# EAGLE design frc_operator_interface (EAGLE 7.5.0)
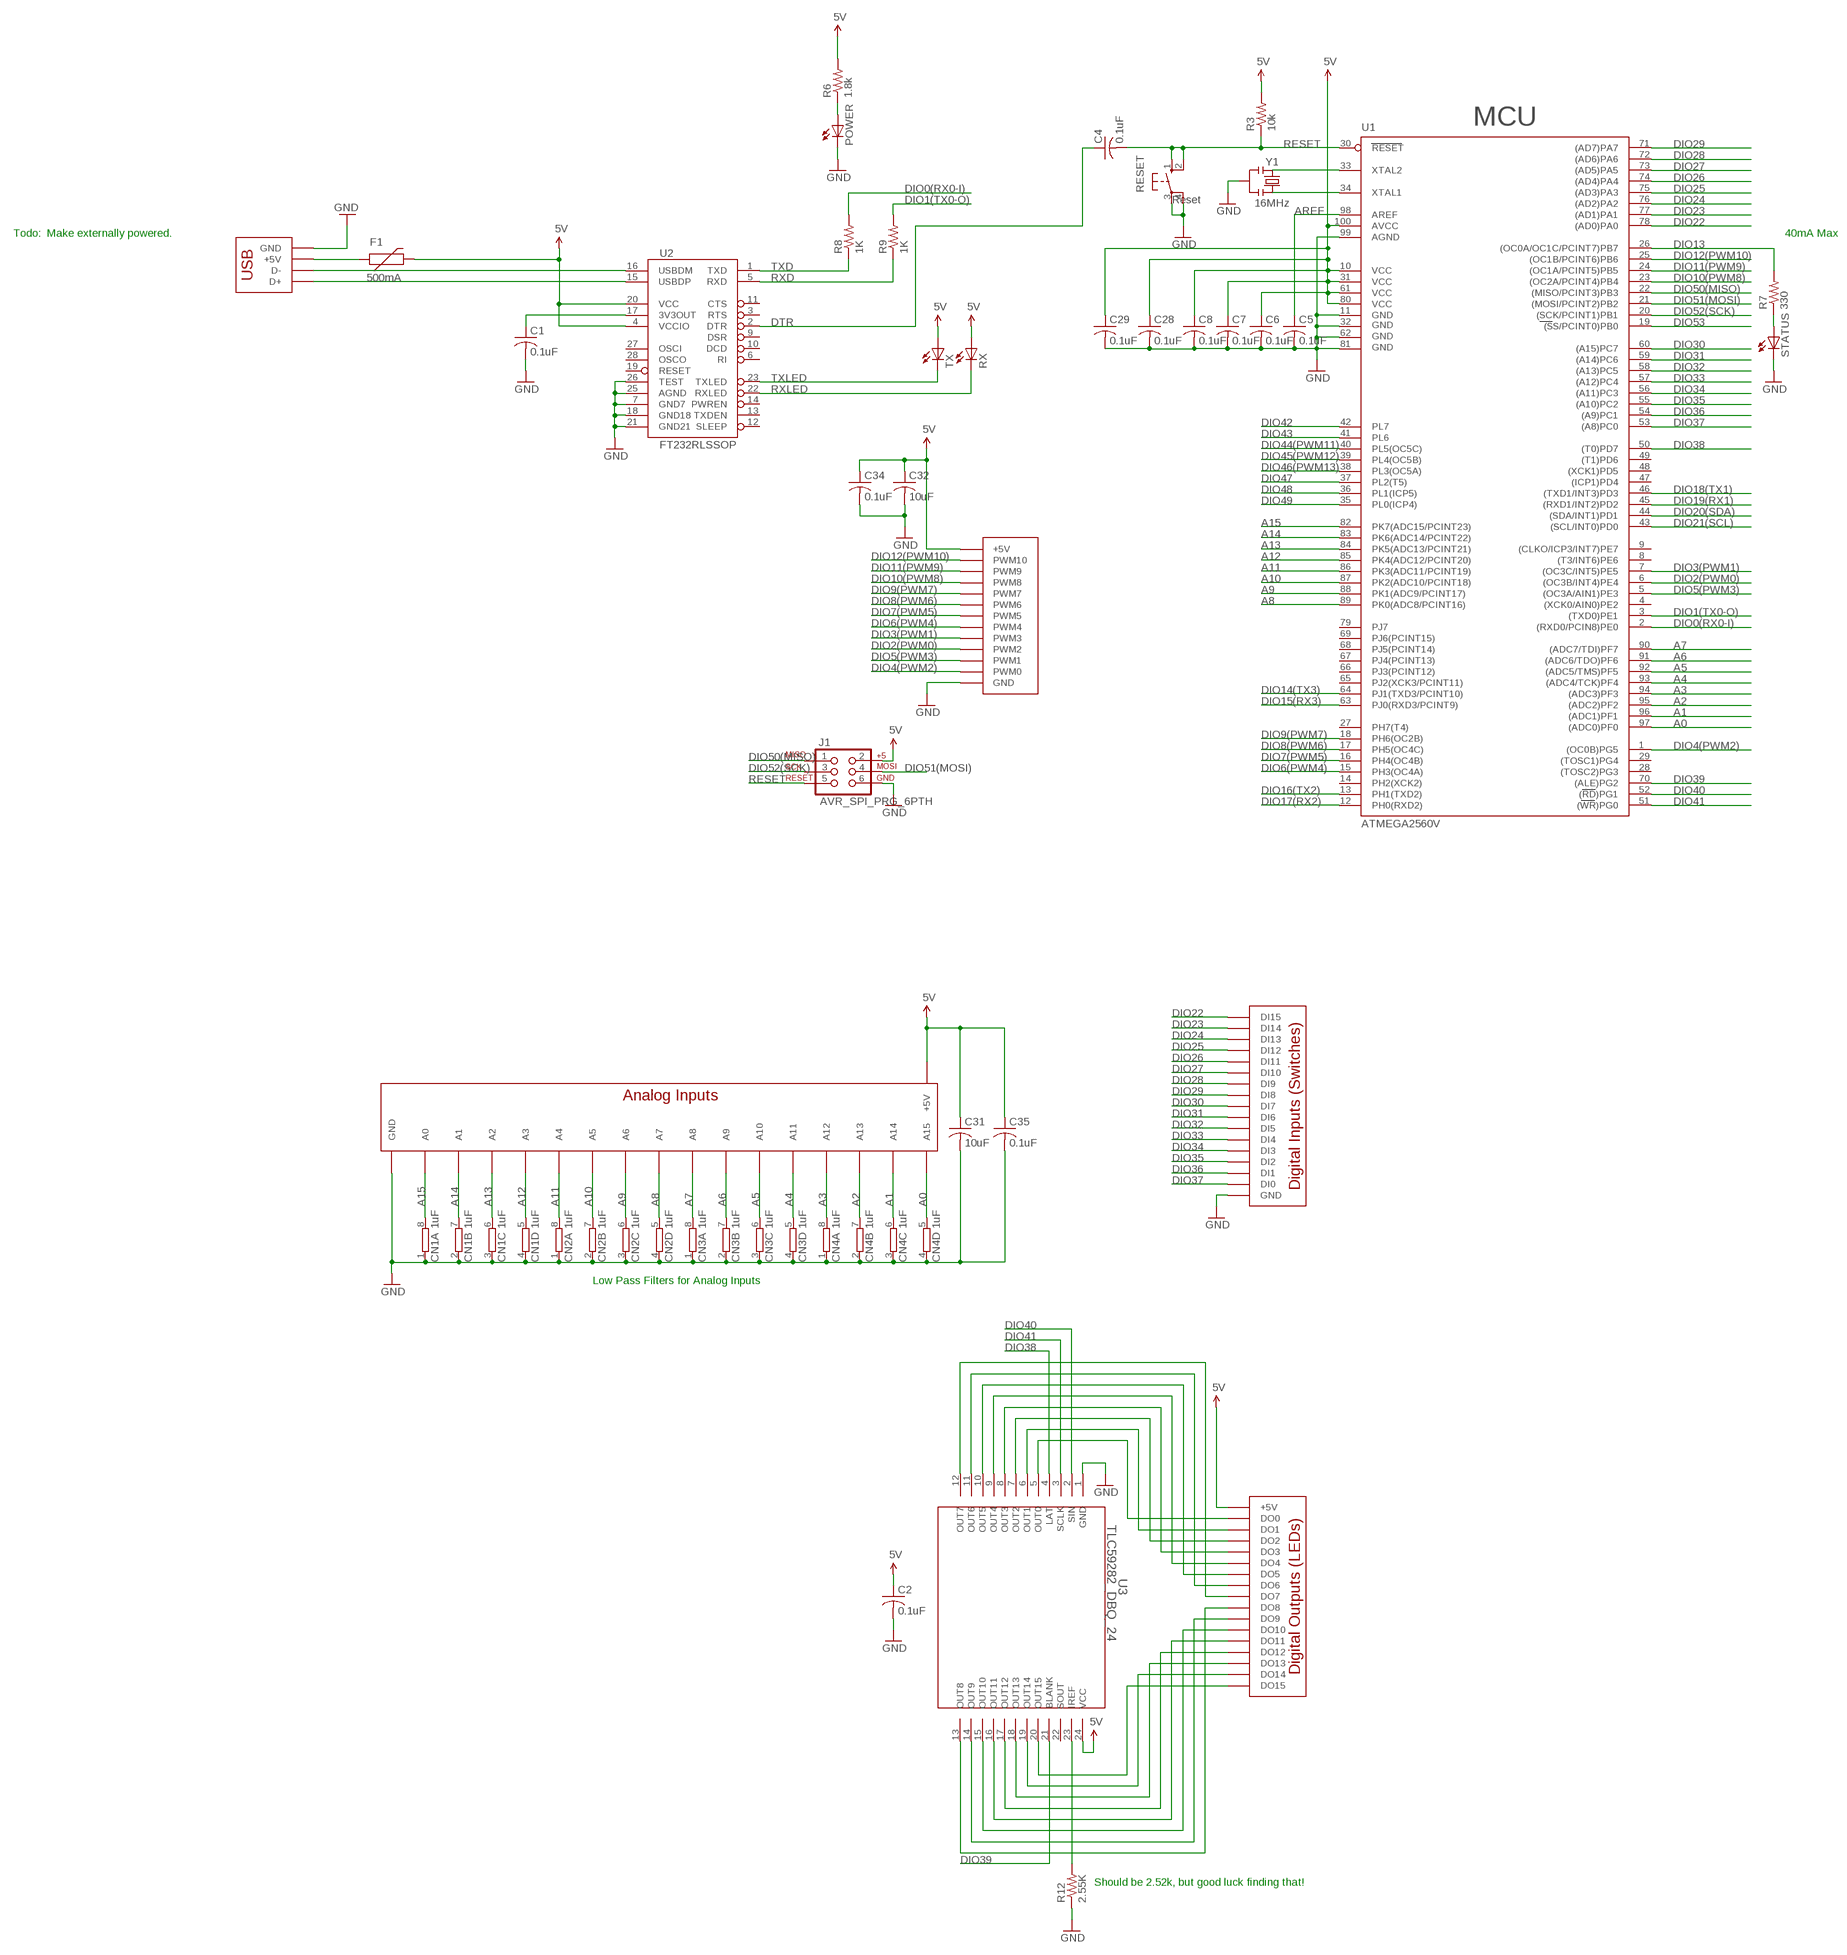
[diagram p0: schematic, sheet 1]

## Parts
C1  0.1uF  C-USC1206  [C1206]
C2  0.1uF  C-USC1206  [C1206]
C4  0.1uF  C-USC1206  [C1206]
C5  0.1uF  C-USC1206  [C1206]
C6  0.1uF  C-USC1206  [C1206]
C7  0.1uF  C-USC1206  [C1206]
C8  0.1uF  C-USC1206  [C1206]
C28  0.1uF  C-USC1206  [C1206]
C29  0.1uF  C-USC1206  [C1206]
C31  10uF  C-USC1206  [C1206]
C32  10uF  C-USC1206  [C1206]
C34  0.1uF  C-USC1206  [C1206]
C35  0.1uF  C-USC1206  [C1206]
CN1  1uF  4R-NEXB38V  [EXB38V]
CN2  1uF  4R-NEXB38V  [EXB38V]
CN3  1uF  4R-NEXB38V  [EXB38V]
CN4  1uF  4R-NEXB38V  [EXB38V]
F1  500mA  PTCSMD  [PTC-1206]
J1  AVR_SPI_PRG_6PTH  [2X3]
J2  ANALOGHEADER  [ANALOGHEADER]
J3  DIGITALIN  [DIGITALIN]
J4  DIGITALOUTPUTS  [DIGITALOUT]
J5  PWMHEADER  [PWMHEADER]
J6  UE27BC54130-USB  [UE27BC54130-USB]
POWER  LED3MM  [LED3MM]
R3  10k  R-US_M1206  [M1206]
R6  1.8k  R-US_M1206  [M1206]
R7  330  R-US_M1206  [M1206]
R8  1K  R-US_M1206  [M1206]
R9  1K  R-US_M1206  [M1206]
R12  2.55K  R-US_M1206  [M1206]
RESET  10-XX  [B3F-10XX]
RX  LED3MM  [LED3MM]
STATUS  LED3MM  [LED3MM]
TX  LED3MM  [LED3MM]
U1  ATMEGA2560AU  [TQFP100]
U2  FT232RLSSOP  [SSOP28DB]
U3  TLC59282_DBQ_24  [DBQ24]
Y1  RESONATORSMD  [RESONATOR-SMD]

## Nets
5V [power]: C2.1 C6.1 C7.1 C8.1 C28.1 C29.1 C31.1 C32.1 C34.1 C35.1 F1.2 J1.2 J2.+5V@0(+5V) J2.+5V@1(+5V) J2.+5V@2(+5V) J2.+5V@3(+5V) J2.+5V@4(+5V) J2.+5V@5(+5V) J2.+5V@6(+5V) J2.+5V@7(+5V) J2.+5V@8(+5V) J2.+5V@9(+5V) J2.+5V@10(+5V) J2.+5V@11(+5V) J2.+5V@12(+5V) J2.+5V@13(+5V) J2.+5V@14(+5V) J2.+5V@15(+5V) J4.+5V@0(+5V) J4.+5V@1(+5V) J4.+5V@2(+5V) J4.+5V@3(+5V) J4.+5V@4(+5V) J4.+5V@5(+5V) J4.+5V@6(+5V) J4.+5V@7(+5V) J4.+5V@8(+5V) J4.+5V@9(+5V) J4.+5V@10(+5V) J4.+5V@11(+5V) J4.+5V@12(+5V) J4.+5V@13(+5V) J4.+5V@14(+5V) J4.+5V@15(+5V) J5.+5V@3(+5V) J5.+5V@4(+5V) J5.+5V@5(+5V) J5.+5V@6(+5V) J5.+5V@7(+5V) J5.+5V@8(+5V) J5.+5V@9(+5V) J5.+5V@10(+5V) J5.+5V@11(+5V) J5.+5V@12(+5V) J5.+5V@13(+5V) R3.2 R6.2 RX.A TX.A U1.10(VCC) U1.31(VCC1) U1.61(VCC2) U1.80(VCC3) U1.100(AVCC) U2.4(VCCIO) U2.20(VCC) U3.24(VCC)
A0: CN4.5 J2.15(A15) U1.97((ADC0)PF0)
A1: CN4.6 J2.14(A14) U1.96((ADC1)PF1)
A2: CN4.7 J2.13(A13) U1.95((ADC2)PF2)
A3: CN4.8 J2.12(A12) U1.94((ADC3)PF3)
A4: CN3.5 J2.11(A11) U1.93((ADC4/TCK)PF4)
A5: CN3.6 J2.10(A10) U1.92((ADC5/TMS)PF5)
A6: CN3.7 J2.9(A9) U1.91((ADC6/TDO)PF6)
A7: CN3.8 J2.8(A8) U1.90((ADC7/TDI)PF7)
A8: CN2.5 J2.7(A7) U1.89(PK0(ADC8/PCINT16))
A9: CN2.6 J2.6(A6) U1.88(PK1(ADC9/PCINT17))
A10: CN2.7 J2.5(A5) U1.87(PK2(ADC10/PCINT18))
A11: CN2.8 J2.4(A4) U1.86(PK3(ADC11/PCINT19))
A12: CN1.5 J2.3(A3) U1.85(PK4(ADC12/PCINT20))
A13: CN1.6 J2.2(A2) U1.84(PK5(ADC13/PCINT21))
A14: CN1.7 J2.1(A1) U1.83(PK6(ADC14/PCINT22))
A15: CN1.8 J2.0(A0) U1.82(PK7(ADC15/PCINT23))
AREF: C5.1 U1.98(AREF)
DIO0(RX0-I): R8.2 U1.2((RXD0/PCIN8)PE0)
DIO1(TX0-O): R9.2 U1.3((TXD0)PE1)
DIO2(PWM0): J5.2(PWM2) U1.6((OC3B/INT4)PE4)
DIO3(PWM1): J5.3(PWM3) U1.7((OC3C/INT5)PE5)
DIO4(PWM2): J5.0(PWM0) U1.1((OC0B)PG5)
DIO5(PWM3): J5.1(PWM1) U1.5((OC3A/AIN1)PE3)
DIO6(PWM4): J5.4(PWM4) U1.15(PH3(OC4A))
DIO7(PWM5): J5.5(PWM5) U1.16(PH4(OC4B))
DIO8(PWM6): J5.6(PWM6) U1.17(PH5(OC4C))
DIO9(PWM7): J5.7(PWM7) U1.18(PH6(OC2B))
DIO10(PWM8): J5.8(PWM8) U1.23((OC2A/PCINT4)PB4)
DIO11(PWM9): J5.9(PWM9) U1.24((OC1A/PCINT5)PB5)
DIO12(PWM10): J5.10(PWM10) U1.25((OC1B/PCINT6)PB6)
DIO13: R7.2 U1.26((OC0A/OC1C/PCINT7)PB7)
DIO14(TX3): U1.64(PJ1(TXD3/PCINT10))
DIO15(RX3): U1.63(PJ0(RXD3/PCINT9))
DIO16(TX2): U1.13(PH1(TXD2))
DIO17(RX2): U1.12(PH0(RXD2))
DIO18(TX1): U1.46((TXD1/INT3)PD3)
DIO19(RX1): U1.45((RXD1/INT2)PD2)
DIO20(SDA): U1.44((SDA/INT1)PD1)
DIO21(SCL): U1.43((SCL/INT0)PD0)
DIO22: J3.DI15 U1.78((AD0)PA0)
DIO23: J3.DI14 U1.77((AD1)PA1)
DIO24: J3.DI13 U1.76((AD2)PA2)
DIO25: J3.DI12 U1.75((AD3)PA3)
DIO26: J3.DI11 U1.74((AD4)PA4)
DIO27: J3.DI10 U1.73((AD5)PA5)
DIO28: J3.DI9 U1.72((AD6)PA6)
DIO29: J3.DI8 U1.71((AD7)PA7)
DIO30: J3.DI7 U1.60((A15)PC7)
DIO31: J3.DI6 U1.59((A14)PC6)
DIO32: J3.DI5 U1.58((A13)PC5)
DIO33: J3.DI4 U1.57((A12)PC4)
DIO34: J3.DI3 U1.56((A11)PC3)
DIO35: J3.DI2 U1.55((A10)PC2)
DIO36: J3.DI1 U1.54((A9)PC1)
DIO37: J3.DI0 U1.53((A8)PC0)
DIO38: U1.50((T0)PD7) U3.4(LAT)
DIO39: U1.70((ALE)PG2) U3.21(BLANK)
DIO40: U1.52((RD)PG1) U3.2(SIN)
DIO41: U1.51((WR)PG0) U3.3(SCLK)
DIO42: U1.42(PL7)
DIO43: U1.41(PL6)
DIO44(PWM11): U1.40(PL5(OC5C))
DIO45(PWM12): U1.39(PL4(OC5B))
DIO46(PWM13): U1.38(PL3(OC5A))
DIO47: U1.37(PL2(T5))
DIO48: U1.36(PL1(ICP5))
DIO49: U1.35(PL0(ICP4))
DIO50(MISO): J1.1 U1.22((MISO/PCINT3)PB3)
DIO51(MOSI): J1.4 U1.21((MOSI/PCINT2)PB2)
DIO52(SCK): J1.3 U1.20((SCK/PCINT1)PB1)
DIO53: U1.19((SS/PCINT0)PB0)
DTR: C4.1 U2.2(DTR)
GND [power]: C1.2 C2.2 C5.2 C6.2 C7.2 C8.2 C28.2 C29.2 C31.2 C32.2 C34.2 C35.2 CN1.1 CN1.2 CN1.3 CN1.4 CN2.1 CN2.2 CN2.3 CN2.4 CN3.1 CN3.2 CN3.3 CN3.4 CN4.1 CN4.2 CN4.3 CN4.4 J1.6 J2.GND@0(GND) J2.GND@1(GND) J2.GND@2(GND) J2.GND@3(GND) J2.GND@4(GND) J2.GND@5(GND) J2.GND@6(GND) J2.GND@7(GND) J2.GND@8(GND) J2.GND@9(GND) J2.GND@10(GND) J2.GND@11(GND) J2.GND@12(GND) J2.GND@13(GND) J2.GND@14(GND) J2.GND@15(GND) J3.GND@0(GND) J3.GND@1(GND) J3.GND@2(GND) J3.GND@3(GND) J3.GND@4(GND) J3.GND@5(GND) J3.GND@6(GND) J3.GND@7(GND) J3.GND@8(GND) J3.GND@9(GND) J3.GND@10(GND) J3.GND@11(GND) J3.GND@12(GND) J3.GND@13(GND) J3.GND@14(GND) J3.GND@15(GND) J5.GND@3(GND) J5.GND@4(GND) J5.GND@5(GND) J5.GND@6(GND) J5.GND@7(GND) J5.GND@8(GND) J5.GND@9(GND) J5.GND@10(GND) J5.GND@11(GND) J5.GND@12(GND) J5.GND@13(GND) J6.GND@0(GND) J6.GND@1(GND) J6.GND@2(GND) POWER.K(C) R12.1 RESET.3(P) RESET.4(P1) STATUS.K(C) U1.11(GND) U1.32(GND1) U1.62(GND2) U1.81(GND3) U1.99(AGND) U2.7(GND7) U2.18(GND18) U2.21(GND21) U2.25(AGND) U2.26(TEST) U3.1(GND) Y1.2
N$2: POWER.A R6.1
N$3: R7.1 STATUS.A
N$4: F1.1 J6.+5V
N$21: C1.1 U2.17(3V3OUT)
N$25 [power]: J4.DO1 U3.6(OUT1)
N$26 [power]: J4.DO2 U3.7(OUT2)
N$27 [power]: J4.DO0 U3.5(OUT0)
N$28 [power]: J4.DO3 U3.8(OUT3)
N$29 [power]: J4.DO4 U3.9(OUT4)
N$30 [power]: J4.DO5 U3.10(OUT5)
N$31 [power]: J4.DO6 U3.11(OUT6)
N$32 [power]: J4.DO7 U3.12(OUT7)
N$33 [power]: J4.DO15 U3.20(OUT15)
N$34 [power]: J4.DO14 U3.19(OUT14)
N$35 [power]: J4.DO13 U3.18(OUT13)
N$36 [power]: J4.DO12 U3.17(OUT12)
N$37 [power]: J4.DO11 U3.16(OUT11)
N$38 [power]: J4.DO10 U3.15(OUT10)
N$39 [power]: J4.DO9 U3.14(OUT9)
N$40 [power]: J4.DO8 U3.13(OUT8)
N$41 [power]: R12.2 U3.23(IREF)
N$73: U1.33(XTAL2) Y1.1
N$74: U1.34(XTAL1) Y1.3
RESET: C4.2 J1.5 R3.1 RESET.1(S) RESET.2(S1) U1.30(RESET)
RXD: R9.1 U2.5(RXD)
RXLED: RX.K(C) U2.22(RXLED)
TXD: R8.1 U2.1(TXD)
TXLED: TX.K(C) U2.23(TXLED)
USB_D_N: J6.-DATA(D-) U2.16(USBDM)
USB_D_P: J6.+DATA(D+) U2.15(USBDP)
Unconnected: U1.4((XCK0/AIN0)PE2) U1.8((T3/INT6)PE6) U1.9((CLKO/ICP3/INT7)PE7) U1.14(PH2(XCK2)) U1.27(PH7(T4)) U1.28((TOSC2)PG3) U1.29((TOSC1)PG4) U1.47((ICP1)PD4) U1.48((XCK1)PD5) U1.49((T1)PD6) U1.65(PJ2(XCK3/PCINT11)) U1.66(PJ3(PCINT12)) U1.67(PJ4(PCINT13)) U1.68(PJ5(PCINT14)) U1.69(PJ6(PCINT15)) U1.79(PJ7) U2.3(RTS) U2.6(RI) U2.9(DSR) U2.10(DCD) U2.11(CTS) U2.12(SLEEP) U2.13(TXDEN) U2.14(PWREN) U2.19(RESET) U2.27(OSCI) U2.28(OSCO) U3.22(SOUT)

## Notes on the sheet
- MCU
- Reset
- 16MHz
- Todo: | Make externally powered. | 40mA Max
- ATMEGA2560V
- Low Pass Filters for Analog Inputs
- Should be 2.52k, but good luck finding that!

## Library data of the parts
C1 C2 C4-C8 C28 C29 C31 C32 C34 C35 = rcl:C-US: CAPACITOR, American symbol
CN1-CN4 = resistor-dil:4R-N: Array Chip Resistor Source: RS Component / Phycomp; OC_FARNELL: unknown; OC_NEWARK: unknown
F1 = SparkFun-PowerIC:PTC: Resettable Fuse PTC Resettable Fuse. Spark Fun Electronics SKU : COM-08357; PROD_ID: RES-11150
J1 = SparkFun:AVR_SPI_PRG_6: AVR ISP 6 Pin This is the reduced ISP connector for AVR programming. Common on Arduino. This footprint will take up less PCB space and can be used with a 10-pin to 6-pin adapter such as SKU: BOB-08508
J2 = teamFusion:ANALOGHEADER
J3 = teamFusion:DIGITALIN
J4 = teamFusion:DIGITALOUTPUTS
J5 = teamFusion:PWMHEADER
J6 = teamFusion:UE27BC54130-USB
POWER RX STATUS TX = SparkFun-LED:LED: LEDs Standard schematic elements and footprints for 5mm, 3mm, 1206, and 0603 sized LEDs. 5mm - Spark Fun Electronics SKU : COM-00529 (and others)
R3 R6-R9 R12 = rcl:R-US_: RESISTOR, American symbol
RESET = switch-omron:10-XX: OMRON SWITCH; MPN: B3F-1000; OC_FARNELL: 176432; OC_NEWARK: 36M3542
U1 = SparkFun:ATMEGA2560: MICROCONTROLLER 64/128/256 Kbytes FLASH 4 Kbytes EEPROM 8 Kbytes SRAM 86 General Purpose I/O pins 12-channels16-bit PWM 4 x Serial USARTs 16-channels 10-bit A/D
U2 = SparkFun:FT232RL: USB UART FT232RL 4th Generation USB UART (USB <-> Serial) Controller. Spark Fun Electronics SKU : COM-00650
U3 = teamFusion:TLC59282_DBQ_24; DATASHEETURL: http://www.ti.com/lit/gpn/TLC59282; DESCRIPTION: 16-Channel Constant Current LED Driver with 4-Channel Grouped Delay; FAMILY_NAME: LED DRIVER; GENERIC_PART_NUMBER: TLC59282; INDUSTRY_STD_PKG_TYPE: SSOP/QSOP; MANUFACTURER: Texas Instruments; MANUFACTURER_PART_NUMBER: tlc59282_dbq_24; PACKAGE_DESIGNATOR: DBQ; PIN_COUNT: 24; VENDOR: Texas Instruments
Y1 = SparkFun:RESONATOR: Resonator Small SMD resonator. This is the itty bitty 10/20MHz resonators with built in caps. CSTCE10M0G55 and CSTCE20M0V53. Footprint has been reviewed closely but hasn't been tested yet.

## Net classes
0 default: width 0.203 mm
1 power: width 0.254 mm

## Board
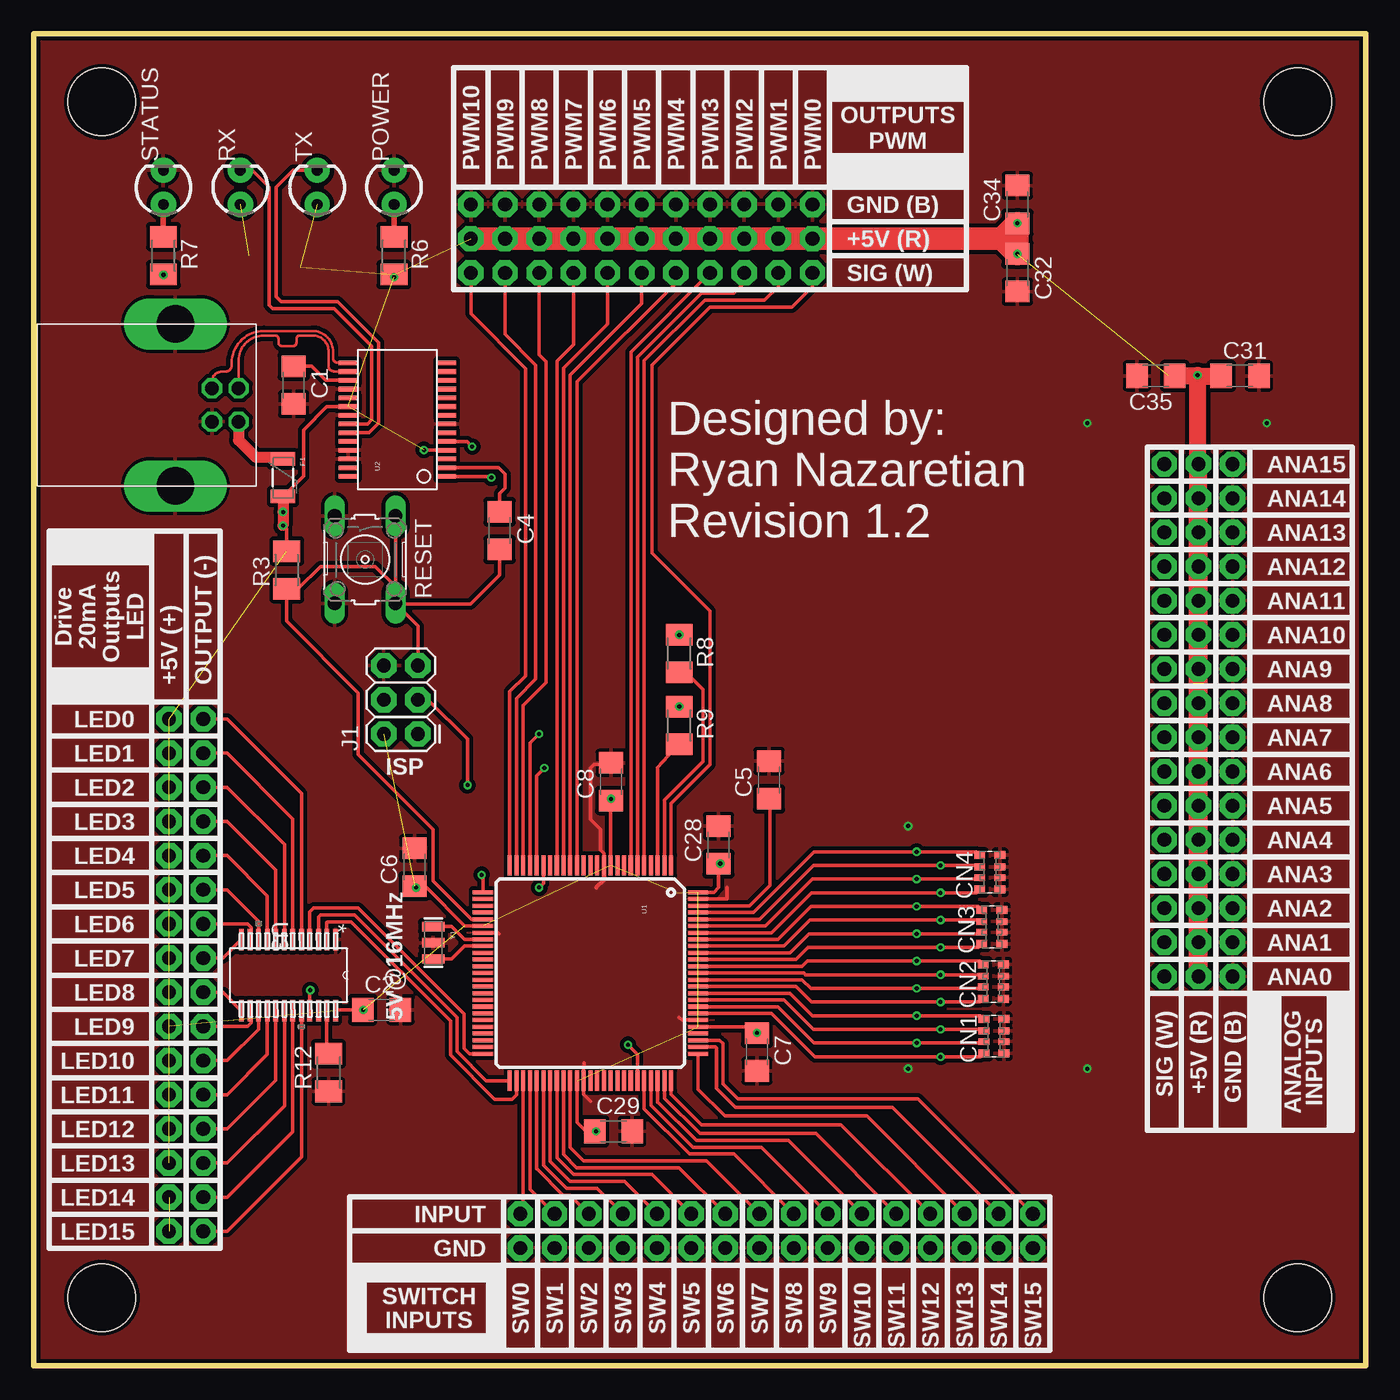
[diagram p1: board, top side]
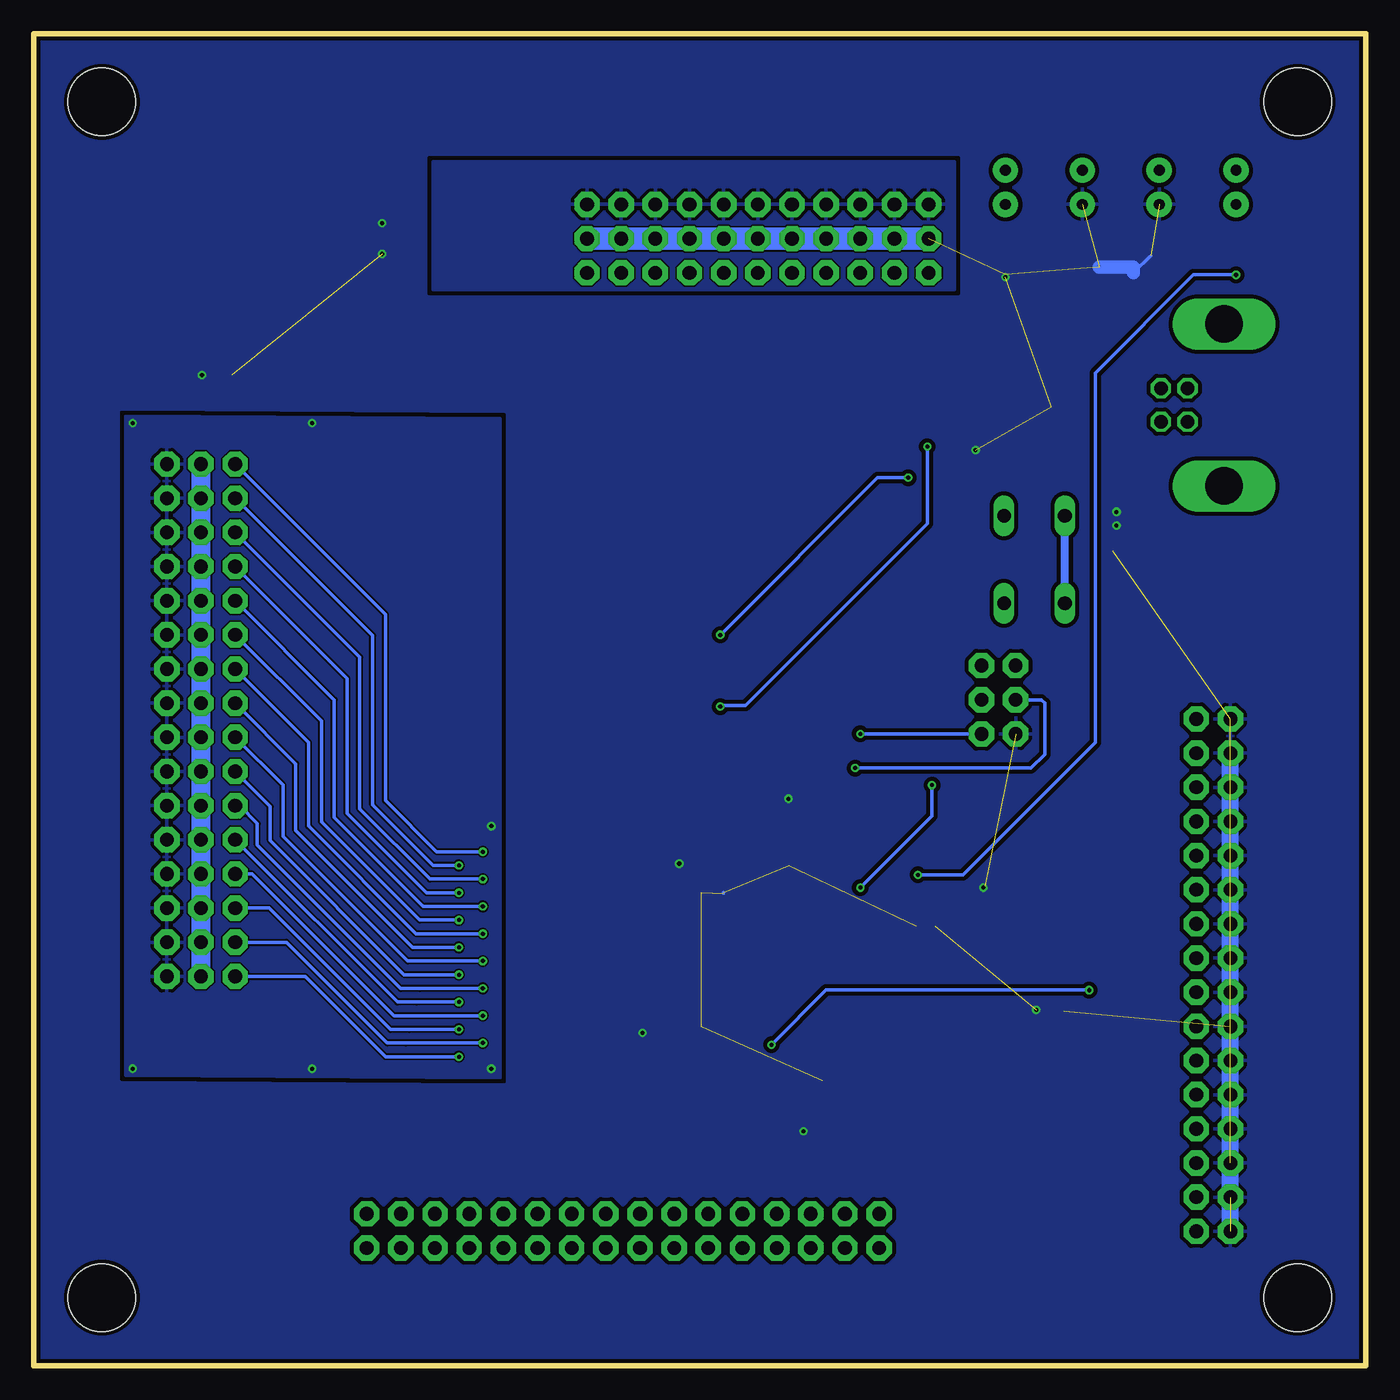
[diagram p2: board, bottom side, seen from below]

Size 99.06 x 99.06 mm. Coordinates in mm from the lower left corner, seen from the top.
Outline: 0,0 0,99.06 99.06,99.06 99.06,0 0,0
Copper layers (1*16): Top 0.035mm / dielectric 1.5mm / Bottom 0.035mm
Design rules "dirt_cheap_dirty_boards.v1": minimum track width 5mil, minimum drill 12mil, track to track 5mil, track to pad 5mil, pad to pad 5mil, via to via 5mil, smd to smd 0mil, copper to edge 10mil, drill to drill 10mil, minimum pad ring 10mil, minimum via ring 6mil, stop-mask expansion 2mil, vias tented up to drill 25mil, thermal gap 10mil
Holes 5.03 mm at 5.08,93.98 93.98,93.98 93.98,5.08 5.08,5.08

### Footprints (pad centres in the part's own frame; a part is rotated, then mirrored left to right if it is on the bottom)
C1206 = smd 1.6 x 1.8: 1 -1.4,0; 2 1.4,0
EXB38V = smd 0.6 x 0.8: 1 -1.275,-0.75; 4 1.275,-0.75; 5 1.275,0.75; 8 -1.275,0.75 | smd 0.5 x 0.8: 2 -0.4,-0.75; 3 0.4,-0.75; 6 0.4,0.75; 7 -0.4,0.75
PTC-1206 = smd 1 x 1.8: 1 -1.4,0; 2 1.4,0
2X3 = drill 1.016 pad 1.88 octagon: 1 0,0; 2 0,2.54; 3 2.54,0; 4 2.54,2.54; 5 5.08,0; 6 5.08,2.54
ANALOGHEADER = drill 1.016 pad 1.88 octagon: 0 1.27,11.43; 1 1.27,13.97; 2 1.27,16.51; 3 1.27,19.05; 4 1.27,21.59; 5 1.27,24.13; 6 1.27,26.67; 7 1.27,29.21; 8 1.27,31.75; 9 1.27,34.29; 10 1.27,36.83; 11 1.27,39.37; 12 1.27,41.91; 13 1.27,44.45; 14 1.27,46.99; 15 1.27,49.53; +5V@0 3.81,11.43; +5V@1 3.81,13.97; +5V@2 3.81,16.51; +5V@3 3.81,19.05; +5V@4 3.81,21.59; +5V@5 3.81,24.13; +5V@6 3.81,26.67; +5V@7 3.81,29.21; +5V@8 3.81,31.75; +5V@9 3.81,34.29; +5V@10 3.81,36.83; +5V@11 3.81,39.37; +5V@12 3.81,41.91; +5V@13 3.81,44.45; +5V@14 3.81,46.99; +5V@15 3.81,49.53; GND@0 6.35,11.43; GND@1 6.35,13.97; GND@2 6.35,16.51; GND@3 6.35,19.05; GND@4 6.35,21.59; GND@5 6.35,24.13; GND@6 6.35,26.67; GND@7 6.35,29.21; GND@8 6.35,31.75; GND@9 6.35,34.29; GND@10 6.35,36.83; GND@11 6.35,39.37; GND@12 6.35,41.91; GND@13 6.35,44.45; GND@14 6.35,46.99; GND@15 6.35,49.53
DIGITALIN = drill 1.016 pad 1.88 octagon: DI0 -17.78,2.54; DI1 -15.24,2.54; DI2 -12.7,2.54; DI3 -10.16,2.54; DI4 -7.62,2.54; DI5 -5.08,2.54; DI6 -2.54,2.54; DI7 0,2.54; DI8 2.54,2.54; DI9 5.08,2.54; DI10 7.62,2.54; DI11 10.16,2.54; DI12 12.7,2.54; DI13 15.24,2.54; DI14 17.78,2.54; DI15 20.32,2.54; GND@0 -17.78,0; GND@1 -15.24,0; GND@2 -12.7,0; GND@3 -10.16,0; GND@4 -7.62,0; GND@5 -5.08,0; GND@6 -2.54,0; GND@7 0,0; GND@8 2.54,0; GND@9 5.08,0; GND@10 7.62,0; GND@11 10.16,0; GND@12 12.7,0; GND@13 15.24,0; GND@14 17.78,0; GND@15 20.32,0
DIGITALOUT = drill 1.016 pad 1.88 octagon: +5V@0 -15.24,-1.27; +5V@1 -12.7,-1.27; +5V@2 -10.16,-1.27; +5V@3 -7.62,-1.27; +5V@4 -5.08,-1.27; +5V@5 -2.54,-1.27; +5V@6 0,-1.27; +5V@7 2.54,-1.27; +5V@8 5.08,-1.27; +5V@9 7.62,-1.27; +5V@10 10.16,-1.27; +5V@11 12.7,-1.27; +5V@12 15.24,-1.27; +5V@13 17.78,-1.27; +5V@14 20.32,-1.27; +5V@15 22.86,-1.27; DO0 -15.24,1.27; DO1 -12.7,1.27; DO2 -10.16,1.27; DO3 -7.62,1.27; DO4 -5.08,1.27; DO5 -2.54,1.27; DO6 0,1.27; DO7 2.54,1.27; DO8 5.08,1.27; DO9 7.62,1.27; DO10 10.16,1.27; DO11 12.7,1.27; DO12 15.24,1.27; DO13 17.78,1.27; DO14 20.32,1.27; DO15 22.86,1.27
PWMHEADER = drill 1.016 pad 1.88 octagon: 0 1.27,11.43; 1 1.27,13.97; 2 1.27,16.51; 3 1.27,19.05; 4 1.27,21.59; 5 1.27,24.13; 6 1.27,26.67; 7 1.27,29.21; 8 1.27,31.75; 9 1.27,34.29; 10 1.27,36.83; +5V@3 3.81,36.83; +5V@4 3.81,34.29; +5V@5 3.81,31.75; +5V@6 3.81,29.21; +5V@7 3.81,26.67; +5V@8 3.81,24.13; +5V@9 3.81,21.59; +5V@10 3.81,19.05; +5V@11 3.81,16.51; +5V@12 3.81,13.97; +5V@13 3.81,11.43; GND@3 6.35,36.83; GND@4 6.35,34.29; GND@5 6.35,31.75; GND@6 6.35,29.21; GND@7 6.35,26.67; GND@8 6.35,24.13; GND@9 6.35,21.59; GND@10 6.35,19.05; GND@11 6.35,16.51; GND@12 6.35,13.97; GND@13 6.35,11.43
UE27BC54130-USB = drill 1 octagon: +5V 7.264,14.986; +DATA 4.775,13.005; -DATA 4.775,14.986; GND@0 7.264,13.005 | drill 2.8 long: GND@1 0,10.287; GND@2 12.04,10.287
LED3MM = drill 0.813 pad 1.88: A -1.27,0; K 1.27,0
M1206 = smd 1.6 x 2: 1 -1.4,0; 2 1.4,0
B3F-10XX = drill 1.016 long: 1 -3.251,2.261; 2 3.251,2.261; 3 -3.251,-2.261; 4 3.251,-2.261
TQFP100 = smd 1.5 x 0.3: 1 -8,6; 2 -8,5.5; 3 -8,5; 4 -8,4.5; 5 -8,4; 6 -8,3.5; 7 -8,3; 8 -8,2.5; 9 -8,2; 10 -8,1.5; 11 -8,1; 12 -8,0.5; 13 -8,0; 14 -8,-0.5; 15 -8,-1; 16 -8,-1.5; 17 -8,-2; 18 -8,-2.5; 19 -8,-3; 20 -8,-3.5; 21 -8,-4; 22 -8,-4.5; 23 -8,-5; 24 -8,-5.5; 25 -8,-6; 51 8,-6; 52 8,-5.5; 53 8,-5; 54 8,-4.5; 55 8,-4; 56 8,-3.5; 57 8,-3; 58 8,-2.5; 59 8,-2; 60 8,-1.5; 61 8,-1; 62 8,-0.5; 63 8,0; 64 8,0.5; 65 8,1; 66 8,1.5; 67 8,2; 68 8,2.5; 69 8,3; 70 8,3.5; 71 8,4; 72 8,4.5; 73 8,5; 74 8,5.5; 75 8,6 | smd 0.3 x 1.5: 26 -6,-8; 27 -5.5,-8; 28 -5,-8; 29 -4.5,-8; 30 -4,-8; 31 -3.5,-8; 32 -3,-8; 33 -2.5,-8; 34 -2,-8; 35 -1.5,-8; 36 -1,-8; 37 -0.5,-8; 38 0,-8; 39 0.5,-8; 40 1,-8; 41 1.5,-8; 42 2,-8; 43 2.5,-8; 44 3,-8; 45 3.5,-8; 46 4,-8; 47 4.5,-8; 48 5,-8; 49 5.5,-8; 50 6,-8; 76 6,8; 77 5.5,8; 78 5,8; 79 4.5,8; 80 4,8; 81 3.5,8; 82 3,8; 83 2.5,8; 84 2,8; 85 1.5,8; 86 1,8; 87 0.5,8; 88 0,8; 89 -0.5,8; 90 -1,8; 91 -1.5,8; 92 -2,8; 93 -2.5,8; 94 -3,8; 95 -3.5,8; 96 -4,8; 97 -4.5,8; 98 -5,8; 99 -5.5,8; 100 -6,8
SSOP28DB = smd 0.348 x 1.397: 1 -4.225,-3.656; 2 -3.575,-3.656; 3 -2.925,-3.656; 4 -2.275,-3.656; 5 -1.625,-3.656; 6 -0.975,-3.656; 7 -0.325,-3.656; 8 0.325,-3.656; 9 0.975,-3.656; 10 1.625,-3.656; 11 2.275,-3.656; 12 2.925,-3.656; 13 3.575,-3.656; 14 4.225,-3.656; 15 4.225,3.656; 16 3.575,3.656; 17 2.925,3.656; 18 2.275,3.656; 19 1.625,3.656; 20 0.975,3.656; 21 0.325,3.656; 22 -0.325,3.656; 23 -0.975,3.656; 24 -1.625,3.656; 25 -2.275,3.656; 26 -2.925,3.656; 27 -3.575,3.656; 28 -4.225,3.656
DBQ24 = smd 1.6 x 0.356: 1 -2.642,3.505; 2 -2.642,2.845; 3 -2.642,2.235; 4 -2.642,1.575; 5 -2.642,0.965; 6 -2.642,0.305; 7 -2.642,-0.305; 8 -2.642,-0.965; 9 -2.642,-1.575; 10 -2.642,-2.235; 11 -2.642,-2.845; 12 -2.642,-3.505; 13 2.642,-3.505; 14 2.642,-2.845; 15 2.642,-2.235; 16 2.642,-1.575; 17 2.642,-0.965; 18 2.642,-0.305; 19 2.642,0.305; 20 2.642,0.965; 21 2.642,1.575; 22 2.642,2.235; 23 2.642,2.845; 24 2.642,3.505
RESONATOR-SMD = smd 0.7 x 1.7: 1 -1.2,0; 2 0,0; 3 1.2,0

### Placement (x,y rotation side)
C1  19.34,72.93 270 top
C2  25.88,26.48 0 top
C4  34.65,62.1 270 top
C5  54.67,43.56 90 top
C6  28.32,37.08 90 top
C7  53.78,23.34 270 top
C8  42.93,43.43 90 top
C28  50.93,38.73 90 top
C29  43.11,17.45 0 top
C31  89.7,73.61 0 top
C32  73.15,81.28 270 top
C34  73.15,86.36 90 top
C35  83.45,73.61 180 top
CN1  71.4,24.51 90 top
CN2  71.35,28.57 90 top
CN3  71.25,32.64 90 top
CN4  71.09,36.7 90 top
F1  18.54,66.04 270 top
J1  28.57,46.99 90 top
J2  82.8,17.53 0 top
J3  53.98,8.76 0 top
J4  11.33,32.86 270 top
J5  69.34,80.01 90 top
J6  0.25,77.47 270 top
POWER  26.8,87.63 90 top
R3  18.82,59.18 90 top
R6  26.8,82.55 270 top
R7  9.65,82.55 270 top
R8  48.01,52.96 270 top
R9  48.01,47.62 270 top
R12  21.93,21.81 90 top
RESET  24.64,59.94 270 top
RX  15.37,87.63 90 top
STATUS  9.65,87.63 90 top
TX  21.08,87.63 90 top
U1  41.4,29.21 270 top
U2  27.05,70.36 90 top
U3  18.95,29.05 270 top
Y1  29.72,31.46 270 top

### Tracks (layer width: path | path; a pad name or v marks a point on that pad's centre or on a via)
5V  (via drill 0.3)  (30 unrouted)
  Top 0.254: U1.100 50.58,35.21 50.93,35.56 C28.1 | v26.8,80.96 R6.2 | U1.10 42.9,41.76 C8.1 v42.93,42.16 | R3.2 18.82,62.2 v18.54,62.48 | U2.20 21.8,71.33 20.07,69.6 20.07,66.16 F1.2 | U3.24 22.56,26.48 v24.51,26.48 24.38,26.54 C2.1 | U1.31 32.06,32.71 29.21,35.56 28.7,35.56 | U1.80 53.34,25.21 v53.78,24.77 C7.1 | U1.61 40.4,18.12 41.08,17.45 C29.1 41.16,17.45 v41.81,17.43 | U2.4 29.04,68.08 v29.02,68.1 | 28.7,35.56 v28.45,35.56 | 28.7,35.56 C6.1 | 84.33,73.66 C35.1 85.01,73.61
  Top 0.406: C28.1 50.93,37.47 v51.05,37.34
  Top 0.61: 18.45,62.39 v18.54,62.48
  Top 0.813: F1.2 v18.54,63.5 v18.54,62.48
  Top 1.27: J2.+5V@15 J2.+5V@14 86.55,64.45 v86.55,73.66 86.5,73.61 | 86.59,73.61 v86.54,73.66 | 86.59,73.61 86.5,73.61 | 86.5,73.61 85.01,73.61 84.96,73.66 | 86.59,73.61 C31.1
  Top 1.422: J2.+5V@0 J2.+5V@1 J2.+5V@2 J2.+5V@3 J2.+5V@4 J2.+5V@5 J2.+5V@6 J2.+5V@7 J2.+5V@8 J2.+5V@9 J2.+5V@10 J2.+5V@11 J2.+5V@12 J2.+5V@13 J2.+5V@14
  Top 1.676: 72.01,83.82 J5.+5V@13 J5.+5V@12 J5.+5V@11 J5.+5V@10 J5.+5V@9 J5.+5V@8 J5.+5V@7 J5.+5V@6 J5.+5V@5 J5.+5V@4 J5.+5V@3 | 72.01,83.82 C34.1 C32.1 | C32.1 72.01,83.82
  Bottom 0.254: 47.75,35.14 47.75,35.21 | 17.27,81.28 16,82.55
  Bottom 1.016: 19.81,81.7 17.27,81.7 17.27,81.28
  Bottom 1.27: J4.+5V@15 J4.+5V@1
  Bottom 1.422: J2.+5V@0 J2.+5V@15
  Bottom 1.676: J5.+5V@13 J5.+5V@3
  other vias: 73.15,84.96 73.15,82.68
  pour Bottom (isolate 0.305, rank 2): 0,99.06 99.06,99.06 99.06,0 0,0
A0  (via drill 0.3)
  Top 0.254: CN4.5 70.1,38.23 v65.66,38.23 58.04,38.23 53.52,33.71 U1.97
  Bottom 0.254: v65.66,38.23 69.09,38.23 72.9,42.04 72.9,55.88 J2.15
A1  (via drill 0.3)
  Top 0.254: CN4.6 70.24,37.21 v67.44,37.21 57.98,37.21 53.97,33.21 U1.96
  Bottom 0.254: v67.44,37.21 69.34,37.21 73.85,41.72 73.85,54.29 J2.14
A2  (via drill 0.3)
  Top 0.254: CN4.7 70.24,36.2 v65.66,36.2 57.91,36.2 54.43,32.71 U1.95
  Bottom 0.254: v65.66,36.2 69.6,36.2 74.8,41.4 74.8,52.7 J2.13
A3  (via drill 0.3)
  Top 0.254: CN4.8 70.09,35.17 v67.44,35.17 v67.44,35.18 57.85,35.18 54.88,32.21 U1.94
  Bottom 0.254: v67.44,35.18 69.85,35.18 75.75,41.08 75.75,51.12 J2.12
A4  (via drill 0.3)
  Top 0.254: CN3.5 70.25,34.16 v65.66,34.16 57.78,34.16 55.33,31.71 U1.93
  Bottom 0.254: v65.66,34.16 70.1,34.16 76.71,40.77 76.71,49.53 J2.11
A5  (via drill 0.3)
  Top 0.254: CN3.6 70.39,33.15 v67.44,33.15 57.72,33.15 55.78,31.21 U1.92
  Bottom 0.254: v67.44,33.15 70.36,33.15 77.66,40.45 77.66,47.94 J2.10
A6  (via drill 0.3)
  Top 0.254: CN3.7 70.39,32.13 v65.66,32.13 57.66,32.13 56.24,30.71 U1.91
  Bottom 0.254: v65.66,32.13 70.61,32.13 78.61,40.13 78.61,46.35 J2.9
A7  (via drill 0.3)
  Top 0.254: CN3.8 70.25,31.11 v67.44,31.11 57.59,31.11 56.69,30.21 U1.90
  Bottom 0.254: v67.44,31.11 70.87,31.11 79.57,39.81 79.57,44.77 J2.8
A8  (via drill 0.3)
  Top 0.254: CN2.5 70.35,30.1 v65.66,30.1 57.53,30.1 57.14,29.71 U1.89
  Bottom 0.254: v65.66,30.1 71.25,30.1 80.52,39.37 80.52,43.18 J2.7
A9  (via drill 0.3)
  Top 0.254: CN2.6 70.49,29.08 v67.44,29.08 57.4,29.08 57.28,29.21 U1.88
  Bottom 0.254: 70.1,29.08 v67.44,29.08 71.5,29.08 81.47,39.05 81.47,41.59 J2.6
A10  (via drill 0.3)
  Top 0.254: CN2.7 70.49,28.07 v65.66,28.07 57.78,28.07 57.14,28.71 U1.87
  Bottom 0.254: 70.36,28.07 v65.66,28.07 71.75,28.07 82.42,38.73 82.42,40.32 83.76,41.66 J2.5
A11  (via drill 0.3)
  Top 0.254: CN2.8 70.35,27.05 v67.44,27.05 57.85,27.05 56.69,28.21 U1.86
  Bottom 0.254: 70.61,27.05 v67.44,27.05 72.01,27.05 J2.4
A12  (via drill 0.3)
  Top 0.254: CN1.5 70.4,26.04 v65.66,26.04 57.91,26.04 56.24,27.71 U1.85
  Bottom 0.254: 70.87,26.04 v65.66,26.04 72.26,26.04 82.8,36.58 J2.3
A13  (via drill 0.3)
  Top 0.254: CN1.6 70.54,25.02 v67.44,25.02 57.98,25.02 55.78,27.21 U1.84
  Bottom 0.254: 71.12,25.02 v67.44,25.02 72.52,25.02 81.53,34.04 J2.2
A14  (via drill 0.3)
  Top 0.254: CN1.7 70.54,24 v65.66,24 58.04,24 55.33,26.71 U1.83
  Bottom 0.254: 71.37,24 v65.66,24 72.77,24 80.26,31.5 J2.1
A15  (via drill 0.3)
  Top 0.254: CN1.8 70.4,22.99 v67.44,22.99 58.1,22.99 54.88,26.21 U1.82
  Bottom 0.254: v67.44,22.99 72.9,22.99 78.87,28.96 J2.0
AREF
  Top 0.254: U1.98 53.23,34.21 54.74,35.72 54.74,42.1 C5.1
DIO0(RX0-I)
  Top 0.254: U1.2 46.9,42.08 49.78,44.96 49.78,50.29 48.77,51.31 48.26,51.31 R8.2
DIO1(TX0-O)
  Top 0.254: U1.3 46.4,44.49 R9.2
DIO2(PWM0)
  Top 0.254: U1.6 44.9,75 49.66,79.76 52.07,79.76 52.83,80.52 J5.2
DIO3(PWM1)
  Top 0.254: U1.7 44.4,75.39 J5.3
DIO4(PWM2)
  Top 0.254: U1.1 47.4,41.81 50.29,44.7 50.29,56.13 45.97,60.45 45.97,74.42 50.29,78.74 56.39,78.74 57.91,80.26 J5.0
DIO5(PWM3)
  Top 0.254: U1.5 45.4,74.74 49.91,79.25 54.36,79.25 55.37,80.26 J5.1
DIO6(PWM4)
  Top 0.254: U1.15 40.4,73.17 47.75,80.52 J5.4
DIO7(PWM5)
  Top 0.254: U1.16 39.9,73.68 45.21,78.99 J5.5
DIO8(PWM6)
  Top 0.254: U1.17 39.4,74.2 42.67,77.47 J5.6
DIO9(PWM7)
  Top 0.254: U1.18 38.9,74.72 40.13,75.95 J5.7
DIO10(PWM8)
  Top 0.254: U1.23 36.4,49.1 38.1,50.8 38.1,74.68 37.59,75.18 J5.8
DIO11(PWM9)
  Top 0.254: J5.9 35.05,76.71 37.34,74.42 37.34,51.05 35.9,49.62 U1.24
DIO12(PWM10)
  Top 0.254: U1.25 35.4,50.13 36.58,51.31 36.58,74.17 32.51,78.23 J5.10
DIO13  (via drill 0.3)
  Top 0.254: U1.26 33.4,36.42 v33.31,36.51 | R7.2 v9.65,81.12
  Bottom 0.254: v33.31,36.51 29.97,36.51 20.13,46.35 20.13,73.82 12.83,81.12 v9.65,81.12
DIO22
  Top 0.254: U1.78 51.01,24.21 51.24,23.97 51.24,20.95 52.36,19.84 65.75,19.84 J3.DI15
DIO23
  Top 0.254: U1.77 50.71,23.71 50.77,23.65 50.77,20.64 52.2,19.21 63.85,19.21 J3.DI14
DIO24
  Top 0.254: U1.76 49.4,20.57 51.4,18.57 61.94,18.57 J3.DI13
DIO25
  Top 0.254: U1.75 47.4,20.19 49.66,17.94 60.04,17.94 J3.DI12
DIO26
  Top 0.254: U1.74 46.9,19.9 49.53,17.27 58.17,17.27 J3.DI11
DIO27
  Top 0.254: U1.73 46.4,19.61 46.43,19.61 49.28,16.76 56.13,16.76 J3.DI10
DIO28
  Top 0.254: U1.72 45.9,19.38 49.02,16.26 54.1,16.26 J3.DI9
DIO29
  Top 0.254: U1.71 45.4,19.11 48.77,15.75 52.07,15.75 J3.DI8
DIO30
  Top 0.254: U1.60 39.9,16.23 40.89,15.24 50.04,15.24 J3.DI7
DIO31
  Top 0.254: U1.59 39.4,15.72 40.39,14.73 48.01,14.73 J3.DI6
DIO32
  Top 0.254: U1.58 38.9,15.45 40.13,14.22 45.97,14.22 J3.DI5
DIO33
  Top 0.254: U1.57 38.4,15.19 39.88,13.72 43.94,13.72 J3.DI4
DIO34
  Top 0.254: U1.56 37.9,14.93 39.62,13.21 41.91,13.21 J3.DI3
DIO35
  Top 0.254: U1.55 37.4,14.64 37.43,14.64 39.37,12.7 39.88,12.7 J3.DI2
DIO36
  Top 0.254: U1.54 36.9,13.14 J3.DI1
DIO37
  Top 0.254: U1.53 36.4,11.51 J3.DI0
DIO38
  Top 0.254: U3.4 20.53,33.74 20.83,34.04 24.13,34.04 32,26.16 32,23.62 32.42,23.21 U1.50
DIO39  (via drill 0.3)
  Top 0.254: U3.21 20.53,27.9 v20.57,27.94 | U1.70 44.9,23.17 v44.2,23.88
  Bottom 0.254: v20.57,27.94 40.13,27.94 v44.2,23.88
DIO40
  Top 0.254: U3.2 21.8,32.98 21.84,33.02 23.62,33.02 30.99,25.65 30.99,23.11 34.29,19.81 35.56,19.81 35.9,20.15 U1.52
DIO41
  Top 0.254: U3.3 21.19,33.38 21.34,33.53 23.88,33.53 31.5,25.91 31.5,23.37 33.65,21.21 U1.51
DIO50(MISO)  (via drill 0.3)
  Top 0.254: U1.22 36.9,46.3 v37.59,46.99
  Bottom 0.254: v37.59,46.99 J1.1
DIO51(MOSI)  (via drill 0.3)
  Top 0.254: U1.21 37.4,43.88 v37.97,44.45
  Bottom 0.254: v37.97,44.45 24.89,44.45 23.88,45.47 23.88,49.28 24.13,49.53 J1.4
DIO52(SCK)  (via drill 0.3)
  Top 0.254: U1.20 37.9,35.87 v37.59,35.56 | J1.3 29.34,49.53 32.26,46.61 v32.26,43.18
  Bottom 0.254: v37.59,35.56 32.26,40.89 v32.26,43.18
DTR
  Top 0.254: U2.2 34.56,66.78 35.05,66.29 35.05,65.28 34.65,64.88 C4.1
GND  (via drill 0.3)
  Top 0.254: U1.99 51.56,34.71 51.56,35.56 | 42.39,36.22 U1.11 42.4,38.12 42.16,38.35 42.16,39.88 41.4,40.64 41.4,44.45 41.66,44.7 43.05,44.7 C8.2 | U1.32 34.52,32.21 34.62,32.11 | 41.4,19.68 40.9,20.18 U1.62 40.9,22.2 40.93,22.23 40.93,22.54 | 48.01,25.91 48.2,25.71 U1.81 | 33.02,32.21 U1.32 | U1.32
  Top 0.305: U1.11 42.4,36.14 41.82,35.56
  Bottom 0.61: RESET.4 RESET.3
  other vias: 65.02,22.1 65.02,40.13 91.69,70.1 91.69,22.1 78.36,22.1 78.36,70.1
  pour Top (isolate 0.305): 0,99.06 99.06,99.06 99.06,0 0,0
  pour Bottom: 64.36,21.41 92.2,21.59 92.2,70.61 64.36,70.43
  pour Bottom (isolate 0.025): 30.61,89.53 30.61,80.01 69.34,80.01 69.34,89.53
N$2
  Top 0.406: POWER.A R6.1
N$3
  Top 0.406: STATUS.A R7.1
N$4
  Top 0.813: J6.+5V 15.24,68.83 16.51,67.56 18.42,67.56 F1.1
N$21
  Top 0.254: U2.17 21.71,73.28 20.67,74.33 C1.1
N$25
  Top 0.254: J4.DO1 14.38,45.56 19.26,40.68 U3.6
N$26
  Top 0.254: J4.DO2 14.38,43.02 18.65,38.75 U3.7
N$27
  Top 0.254: J4.DO0 14.38,48.1 19.92,42.56 U3.5
N$28
  Top 0.254: J4.DO3 14.38,40.48 17.99,36.87 U3.8
N$29
  Top 0.254: J4.DO4 14.38,37.94 17.38,34.94 U3.9
N$30
  Top 0.254: J4.DO5 14.38,35.4 16.72,33.06 U3.10
N$31
  Top 0.254: J4.DO6 15.91,32.86 16.16,32.61 16.16,31.74 U3.11
N$32
  Top 0.254: J4.DO7 14.08,30.32 U3.12
N$33
  Top 0.254: J4.DO15 14.38,10 19.92,15.54 U3.20
N$34
  Top 0.254: J4.DO14 14.38,12.54 19.26,17.42 U3.19
N$35
  Top 0.254: J4.DO13 14.38,15.08 18.65,19.35 U3.18
N$36
  Top 0.254: J4.DO12 14.38,17.62 17.99,21.23 U3.17
N$37
  Top 0.254: J4.DO11 14.38,20.16 17.38,23.16 U3.16
N$38
  Top 0.254: J4.DO10 14.38,22.7 16.72,25.04 U3.15
N$39
  Top 0.254: J4.DO9 15.91,25.24 16.16,25.5 16.16,26.36 U3.14
N$40
  Top 0.254: J4.DO8 14.08,27.78 U3.13
N$41
  Top 0.254: R12.2 21.8,23.34 U3.23
N$73
  Top 0.254: U1.33 32.04,31.71 31.09,32.66 Y1.1
N$74
  Top 0.254: U1.34 32.04,31.21 31.09,30.26 Y1.3
RESET
  Top 0.254: RESET.2 26.95,56.64 32.5,56.64 34.65,58.8 C4.2 | RESET.2 26.9,57.94 25.4,59.44 21.34,59.44 19.68,57.78 R3.1 18.8,57.76 18.8,55.37 24.13,50.04 24.13,45.47 29.72,39.88 29.72,36.07 32.58,33.21 U1.30 | J1.5 28.57,55.02 RESET.2 | RESET.1 RESET.2
RXD  (via drill 0.3)
  Top 0.203: 47.75,49.53 R9.1
  Top 0.254: U2.5 32.22,68.73 v32.61,68.36 | R9.1
  Bottom 0.254: v32.61,68.36 32.61,62.63 46.13,49.11 47.92,49.11 R9.1
  other vias: 48.01,49.02
RXLED
  Top 0.254: U2.22 24.82,70.03 25.15,70.36 25.15,75.82 22.35,78.61 17.78,78.61 17.53,78.87 17.53,87.63 16.26,88.9 RX.K
TXD  (via drill 0.3)
  Top 0.254: U2.1 33.94,66.13 v34.04,66.04 | R8.1
  Bottom 0.254: v34.04,66.04 36.32,66.04 R8.1
  other vias: 48.01,54.36
TXLED
  Top 0.254: U2.23 24.93,69.38 25.65,70.1 25.65,76.07 22.61,79.12 18.41,79.12 18.03,79.5 18.03,87.63 19.3,88.9 TX.K
USB_D_N
  Top 0.203: J6.-DATA 15.24,74.75 arc-90 17.11,76.62 17.95,76.62 arc-90 18.21,76.36 18.21,76.09 arc90 18.47,75.83 19.28,75.83 arc90 19.54,76.09 19.54,76.36 arc-90 19.8,76.62 20.74,76.62 arc-90 21.93,75.42 21.93,74.33 arc90 22.32,73.95 arc90 22.34,73.93 U2.16
USB_D_P
  Top 0.203: J6.+DATA 13.26,73.2 arc-90 13.97,73.91 14.22,73.91 arc90 14.73,74.42 14.73,74.57 arc-90 17.11,76.95 20.74,76.95 arc-90 22.26,75.42 22.26,74.93 arc90 22.61,74.58 U2.15

### Text on the board
tPlace: ISP | 5V@16MHz
tNames: Designed by: | Ryan Nazaretian | Revision 1.2